# Altium schematic sheet integer layer.SchDoc
size A
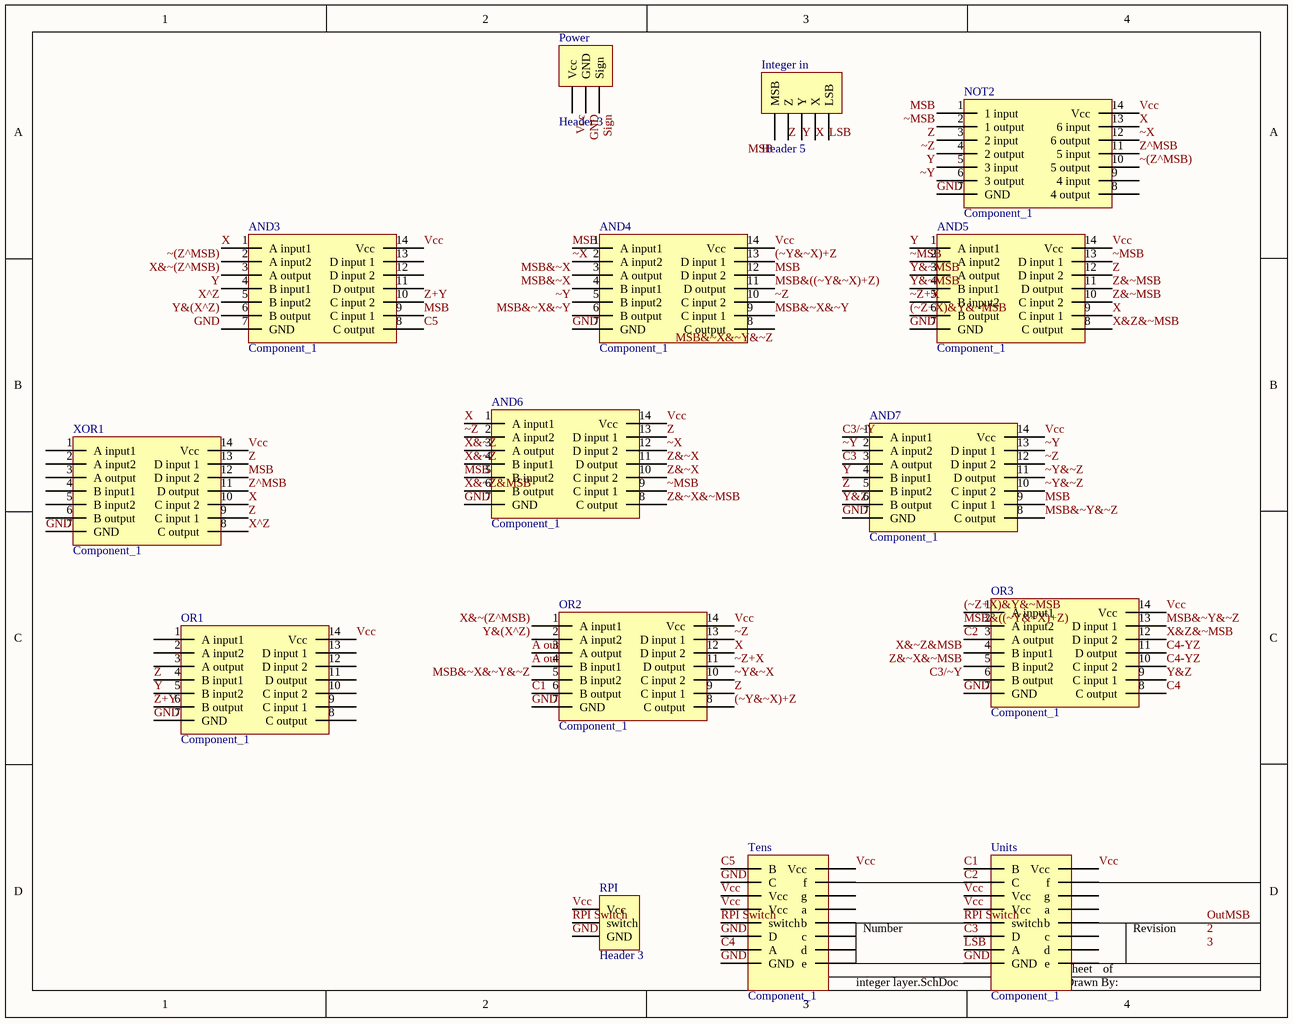
[diagram p0: integer layer.SchDoc]

## Parts
AND3  Component_1  [Gate?]
AND4  Component_1  [Gate?]
AND5  Component_1  [Gate?]
AND6  Component_1  [Gate?]
AND7  Component_1  [Gate?]
Integer_in  Header 5  [HDR1X5]
NOT2  Component_1  [Gate?]
OR1  Component_1  [Gate?]
OR2  Component_1  [Gate?]
OR3  Component_1  [Gate?]
Power  Header 3  [HDR1X3]
RPI  Header 3  [HDR1X3]
Tens  Component_1  [7483]
Units  Component_1  [7483]
XOR1  Component_1  [Gate?]

## Nets
(~Y&~X)+Z: AND4.13(D_input_1) OR2.8(C_output)
(~Z+X)&Y&~MSB: AND5.6(B_output) OR3.1(A_input1)
A out: OR2.3(A_output) OR2.4(B_input1)
C1: OR2.6(B_output) Units.A4(B)
C2: OR3.3(A_output) Units.C3(C)
C3: AND7.3(A_output) Units.C2(D)
C3/~Y: AND7.1(A_input1) OR3.6(B_output)
C4: OR3.8(C_output) Tens.B2(A)
C4-YZ: OR3.10(C_input_2) OR3.11(D_output)
C5: AND3.8(C_output) Tens.A4(B)
GND: AND3.7(GND) AND4.7(GND) AND5.7(GND) AND6.7(GND) AND7.7(GND) NOT2.7(GND) OR1.7(GND) OR2.7(GND) OR3.7(GND) Power.2(GND) RPI.3(GND) Tens.A2(GND) Tens.C2(D) Tens.C3(C) Units.A2(GND) XOR1.7(GND)
LSB: Integer_in.5(LSB) Units.B2(A)
MSB: AND3.9(C_input_1) AND4.1(A_input1) AND4.12(D_input_2) AND6.5(B_input2) AND7.9(C_input_1) Integer_in.1(MSB) NOT2.1(1_input) XOR1.12(D_input_2)
MSB&((~Y&~X)+Z): AND4.11(D_output) OR3.2(A_input2)
MSB&~X: AND4.3(A_output) AND4.4(B_input1)
MSB&~X&~Y: AND4.6(B_output) AND4.9(C_input_1)
MSB&~X&~Y&~Z: AND4.8(C_output) OR2.5(B_input2)
MSB&~Y&~Z: AND7.8(C_output) OR3.13(D_input_1)
RPI Switch: RPI.2(switch) Tens.Vcc(switch) Units.Vcc(switch)
Sign: Power.3(Sign)
Vcc: AND3.14(Vcc) AND4.14(Vcc) AND5.14(Vcc) AND6.14(Vcc) AND7.14(Vcc) NOT2.14(Vcc) OR1.14(Vcc) OR2.14(Vcc) OR3.14(Vcc) Power.1(Vcc) RPI.1(Vcc) Tens.A3(Vcc) Tens.B3(Vcc) Tens.B4(Vcc) Units.A3(Vcc) Units.B3(Vcc) Units.B4(Vcc) XOR1.14(Vcc)
X: AND3.1(A_input1) AND5.9(C_input_1) AND6.1(A_input1) Integer_in.4(X) NOT2.13(6_input) OR2.12(D_input_2) XOR1.10(C_input_2)
X&Z&~MSB: AND5.8(C_output) OR3.12(D_input_2)
X&~(Z^MSB): AND3.3(A_output) OR2.1(A_input1)
X&~Z: AND6.3(A_output) AND6.4(B_input1)
X&~Z&MSB: AND6.6(B_output) OR3.4(B_input1)
X^Z: AND3.5(B_input2) XOR1.8(C_output)
Y: AND3.4(B_input1) AND5.1(A_input1) AND7.4(B_input1) Integer_in.3(Y) NOT2.5(3_input) OR1.5(B_input2)
Y&(X^Z): AND3.6(B_output) OR2.2(A_input2)
Y&Z: AND7.6(B_output) OR3.9(C_input_1)
Y&~MSB: AND5.3(A_output) AND5.4(B_input1)
Z: AND5.12(D_input_2) AND6.13(D_input_1) AND7.5(B_input2) Integer_in.2(Z) NOT2.3(2_input) OR1.4(B_input1) OR2.9(C_input_1) XOR1.9(C_input_1) XOR1.13(D_input_1)
Z&~MSB: AND5.10(C_input_2) AND5.11(D_output)
Z&~X: AND6.10(C_input_2) AND6.11(D_output)
Z&~X&~MSB: AND6.8(C_output) OR3.5(B_input2)
Z+Y: AND3.10(C_input_2) OR1.6(B_output)
Z^MSB: NOT2.11(5_input) XOR1.11(D_output)
~(Z^MSB): AND3.2(A_input2) NOT2.10(5_output)
~MSB: AND5.2(A_input2) AND5.13(D_input_1) AND6.9(C_input_1) NOT2.2(1_output)
~X: AND4.2(A_input2) AND6.12(D_input_2) NOT2.12(6_output)
~Y: AND4.5(B_input2) AND7.2(A_input2) AND7.13(D_input_1) NOT2.6(3_output)
~Y&~X: OR2.10(C_input_2)
~Y&~Z: AND7.10(C_input_2) AND7.11(D_output)
~Z: AND4.10(C_input_2) AND6.2(A_input2) AND7.12(D_input_2) NOT2.4(2_output) OR2.13(D_input_1)
~Z+X: AND5.5(B_input2) OR2.11(D_output)

Not connected (* = marked no-connect by the designer): AND3 11(D_output) 12(D_input_2) 13(D_input_1); NOT2 8(4_output) 9(4_input); OR1 1(A_input1) 2(A_input2) 3(A_output) 8(C_output) 9(C_input_1) 10(C_input_2) 11(D_output) 12(D_input_2) 13(D_input_1); Tens A1(d) B1(c) C0(a) C1(e) C4(f) C5(g) GND(b); Units A1(d) B1(c) C0(a) C1(e) C4(f) C5(g) GND(b); XOR1 1(A_input1) 2(A_input2) 3(A_output) 4(B_input1) 5(B_input2) 6(B_output)

## Notes on the sheet
- Labels drawn without touching a wire or pin: 2, 3, OutMSB

## Library data of the parts
Integer_in = Header 5: Header, 5-Pin; LatestRevisionDate: 17-Jul-2002; LatestRevisionNote: Re-released for DXP Platform.; Publisher: Altium Limited
Power RPI = Header 3: Header, 3-Pin; LatestRevisionDate: 17-Jul-2002; LatestRevisionNote: Re-released for DXP Platform.; Publisher: Altium Limited